# EAGLE schematic GrovePi+_2.2 (EAGLE 6.4)
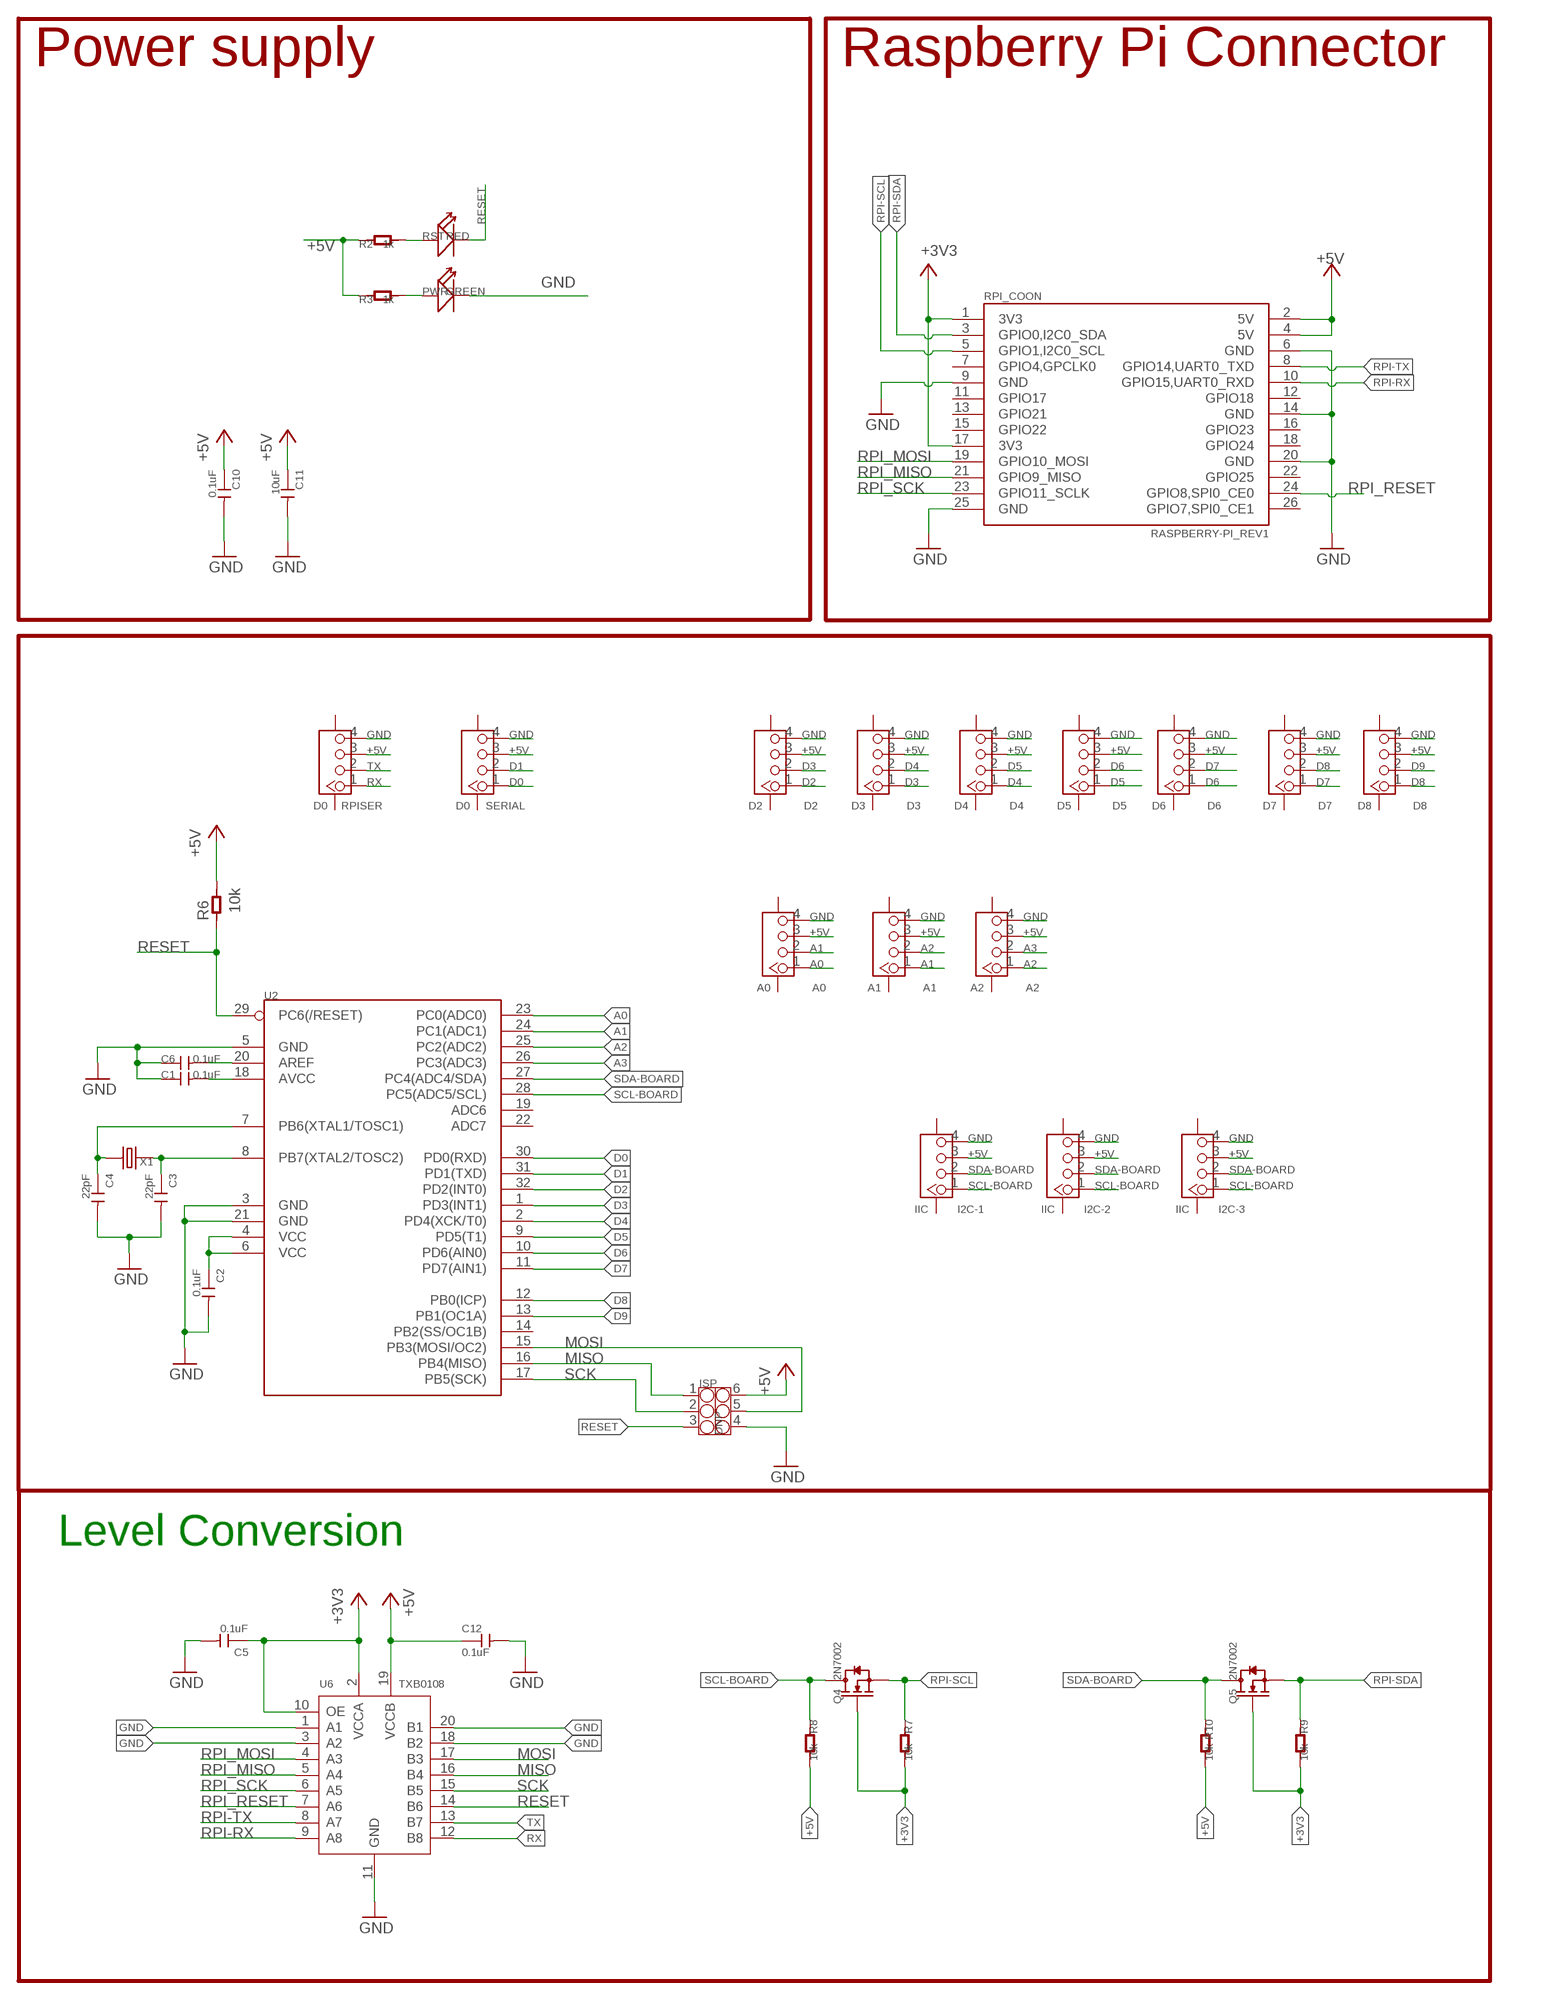
[diagram p0: schematic, sheet 1]

## Parts
A0  A0  GROVE-CONNECTOR-SMD'90D'  [4P-SMD-2.0-90D]
A1  A1  GROVE-CONNECTOR-SMD'90D'  [4P-SMD-2.0-90D]
A2  A2  GROVE-CONNECTOR-SMD'90D'  [4P-SMD-2.0-90D]
C1  0.1uF  CAP-0603  [C0603]
C2  0.1uF  CAP-0603  [C0603]
C3  22pF  CAP-0603  [C0603]
C4  22pF  CAP-0603  [C0603]
C5  0.1uF  CAP-0603  [C0603]
C6  0.1uF  CAP-0603  [C0603]
C10  0.1uF  CAP-0603  [C0603]
C11  10uF  CAP-0805  [C0805]
C12  0.1uF  CAP-0603  [C0603]
D2  D2  GROVE-CONNECTOR-SMD'90D'  [4P-SMD-2.0-90D]
D3  D3  GROVE-CONNECTOR-SMD'90D'  [4P-SMD-2.0-90D]
D4  D4  GROVE-CONNECTOR-SMD'90D'  [4P-SMD-2.0-90D]
D5  D5  GROVE-CONNECTOR-SMD'DD'  [4P-SMD-2.0]
D6  D6  GROVE-CONNECTOR-SMD'DD'  [4P-SMD-2.0]
D7  D7  GROVE-CONNECTOR-SMD'90D'  [4P-SMD-2.0-90D]
D8  D8  GROVE-CONNECTOR-SMD'90D'  [4P-SMD-2.0-90D]
I2C-1  IIC  GROVE-CONNECTOR-SMD'90D'  [4P-SMD-2.0-90D]
I2C-2  IIC  GROVE-CONNECTOR-SMD'90D'  [4P-SMD-2.0-90D]
I2C-3  IIC  GROVE-CONNECTOR-SMD'90D'  [4P-SMD-2.0-90D]
ISP  DNP  CONNECTOR-HEADER-2X3P-3460180P1  [2X3P-2.54-2.54-11.6-3.0-BLACK-MALE]
PWR  GREEN  LED  [LED0603]
Q4  2N7002  MOSFET-N-''  [SOT23]
Q5  2N7002  MOSFET-N-''  [SOT23]
R2  1k  R-0603  [R0603]
R3  1k  R-0603  [R0603]
R6  10k  R-0603  [R0603]
R7  10k  R-0603  [R0603]
R8  10k  R-0603  [R0603]
R9  10k  R-0603  [R0603]
R10  10k  R-0603  [R0603]
RPI_COON  RASPBERRY-PI_REV1  [RASPBERRY-PI_REV1]
RPISER  D0  GROVE-CONNECTOR-SMD'90D'  [4P-SMD-2.0-90D]
RST  RED  LED  [LED0603]
SERIAL  D0  GROVE-CONNECTOR-SMD'90D'  [4P-SMD-2.0-90D]
U2  ATMEGA328P-AU-1030060P1  [TQFP32]
U6  TXB0108  TXS0108E  [TSSOP20]
X1  CRYSTAL  [HC49US]

## Nets
+3V3: C5.1 Q4.1(G) Q5.1(G) R7.2 R9.2 RPI_COON.1(3V3) RPI_COON.17(3V3) U6.2(VCCA) U6.10(OE)
+5V: A0.3 A1.3 A2.3 C10.1 C11.1 C12.1 D2.3 D3.3 D4.3 D5.3 D6.3 D7.3 D8.3 I2C-1.3 I2C-2.3 I2C-3.3 ISP.6 R2.1 R3.1 R6.2 R8.2 R10.2 RPI_COON.2(5V) RPI_COON.4(5V) RPISER.3 SERIAL.3 U6.19(VCCB)
A0: A0.1 U2.23(PC0(ADC0))
A1: A0.2 A1.1 U2.24(PC1(ADC1))
A2: A1.2 A2.1 U2.25(PC2(ADC2))
A3: A2.2 U2.26(PC3(ADC3))
D0: SERIAL.1 U2.30(PD0(RXD))
D1: SERIAL.2 U2.31(PD1(TXD))
D2: D2.1 U2.32(PD2(INT0))
D3: D2.2 D3.1 U2.1(PD3(INT1))
D4: D3.2 D4.1 U2.2(PD4(XCK/T0))
D5: D4.2 D5.1 U2.9(PD5(T1))
D6: D5.2 D6.1 U2.10(PD6(AIN0))
D7: D6.2 D7.1 U2.11(PD7(AIN1))
D8: D7.2 D8.1 U2.12(PB0(ICP))
D9: D8.2 U2.13(PB1(OC1A))
GND: A0.4 A1.4 A2.4 C1.1 C2.2 C3.2 C4.2 C5.2 C6.1 C10.2 C11.2 C12.2 D2.4 D3.4 D4.4 D5.4 D6.4 D7.4 D8.4 I2C-1.4 I2C-2.4 I2C-3.4 ISP.4 PWR.- RPI_COON.6(GND) RPI_COON.9(GND) RPI_COON.14(GND) RPI_COON.20(GND) RPI_COON.25(GND) RPISER.4 SERIAL.4 U2.3(GND) U2.5(GND) U2.21(GND) U6.1(A1) U6.3(A2) U6.11(GND) U6.18(B2) U6.20(B1)
MISO: ISP.1 U2.16(PB4(MISO)) U6.16(B4)
MOSI: ISP.5 U2.15(PB3(MOSI/OC2)) U6.17(B3)
N$1: C3.1 U2.8(PB7(XTAL2/TOSC2)) X1.1
N$2: PWR.+ R3.2
N$3: C4.1 U2.7(PB6(XTAL1/TOSC1)) X1.2
N$4: C1.2 U2.18(AVCC)
N$17: R2.2 RST.+
N$19: C2.1 U2.4(VCC) U2.6(VCC)
N$20: C6.2 U2.20(AREF)
RESET: ISP.3 R6.1 RST.- U2.29(PC6(/RESET)) U6.14(B6)
RPI-RX: RPI_COON.10(GPIO15,UART0_RXD) U6.9(A8)
RPI-SCL: Q4.2(S) R7.1 RPI_COON.5(GPIO1,I2C0_SCL)
RPI-SDA: Q5.2(S) R9.1 RPI_COON.3(GPIO0,I2C0_SDA)
RPI-TX: RPI_COON.8(GPIO14,UART0_TXD) U6.8(A7)
RPI_MISO: RPI_COON.21(GPIO9_MISO) U6.5(A4)
RPI_MOSI: RPI_COON.19(GPIO10_MOSI) U6.4(A3)
RPI_RESET: RPI_COON.24(GPIO8,SPI0_CE0) U6.7(A6)
RPI_SCK: RPI_COON.23(GPIO11_SCLK) U6.6(A5)
RX: RPISER.1 U6.12(B8)
SCK: ISP.2 U2.17(PB5(SCK)) U6.15(B5)
SCL-BOARD: I2C-1.1 I2C-2.1 I2C-3.1 Q4.3(D) R8.1 U2.28(PC5(ADC5/SCL))
SDA-BOARD: I2C-1.2 I2C-2.2 I2C-3.2 Q5.3(D) R10.1 U2.27(PC4(ADC4/SDA))
TX: RPISER.2 U6.13(B7)
Unconnected: A0.SS1 A0.SS2 A1.SS1 A1.SS2 A2.SS1 A2.SS2 D2.SS1 D2.SS2 D3.SS1 D3.SS2 D4.SS1 D4.SS2 D5.SS1 D5.SS2 D6.SS1 D6.SS2 D7.SS1 D7.SS2 D8.SS1 D8.SS2 I2C-1.SS1 I2C-1.SS2 I2C-2.SS1 I2C-2.SS2 I2C-3.SS1 I2C-3.SS2 RPI_COON.7(GPIO4,GPCLK0) RPI_COON.11(GPIO17) RPI_COON.12(GPIO18) RPI_COON.13(GPIO21) RPI_COON.15(GPIO22) RPI_COON.16(GPIO23) RPI_COON.18(GPIO24) RPI_COON.22(GPIO25) RPI_COON.26(GPIO7,SPI0_CE1) RPISER.SS1 RPISER.SS2 SERIAL.SS1 SERIAL.SS2 U2.14(PB2(SS/OC1B)) U2.19(ADC6) U2.22(ADC7)

## Notes on the sheet
- Power supply | Raspberry Pi Connector
- Level Conversion

## Library data of the parts
A0 A1 A2 D2-D8 I2C-1-I2C-3 RPISER SERIAL = Connector-new:GROVE-CONNECTOR-SMD: 4P-SMD-2.0:320110030;4P-SMD-2.0-90D:320110032
C1-C6 C10-C12 = OPL:CAP: Ceramic Capacitors
ISP = OPL:CONNECTOR-HEADER-2X3P
PWR RST = OPL:LED*: LED
Q4 Q5 = OPL:MOSFET-N: CJ2302：SMD MOSFET N-CH 20V-2.1A
R2 R3 R6-R10 = OPL:R*
RPI_COON = RaspberryPi:RASPBERRY-PI_REV1: Raspberry Pi Board <http://www.raspberrypi.org/> Jacques Lagnel V1.0 (beta) 2012 Mateusz Bawaj V1.1 (beta) 2012 Board dimension: Forum 3D model <http://www.raspberrypi.org/forum/general-discussion/mechanical-profile-3d-models?value=3d%20model&type=1&include=1&search=1&ret=all> The GPIO Connector (P1): http://elinux.org/RPi_Low-level_peripherals
U2 = OPL:ATMEGA328P-AU: 8-bit AVR Microcontroller with 32K Bytes In-System Programmable Flash
U6 = template:TXS0108E: 8-BIT BIDIRECTIONAL VOLTAGE-LEVEL TRANSLATOR FOR OPEN-DRAIN AND PUSH-PULL APPLICATIONS
X1 = OPL:CRYSTAL*

## Net classes
0 default: width 0.203 mm
2 POWER: width 0.152 mm, drill 0.356 mm, clearance 0.051 mm